# EAGLE design v1 (EAGLE 7.2.0)
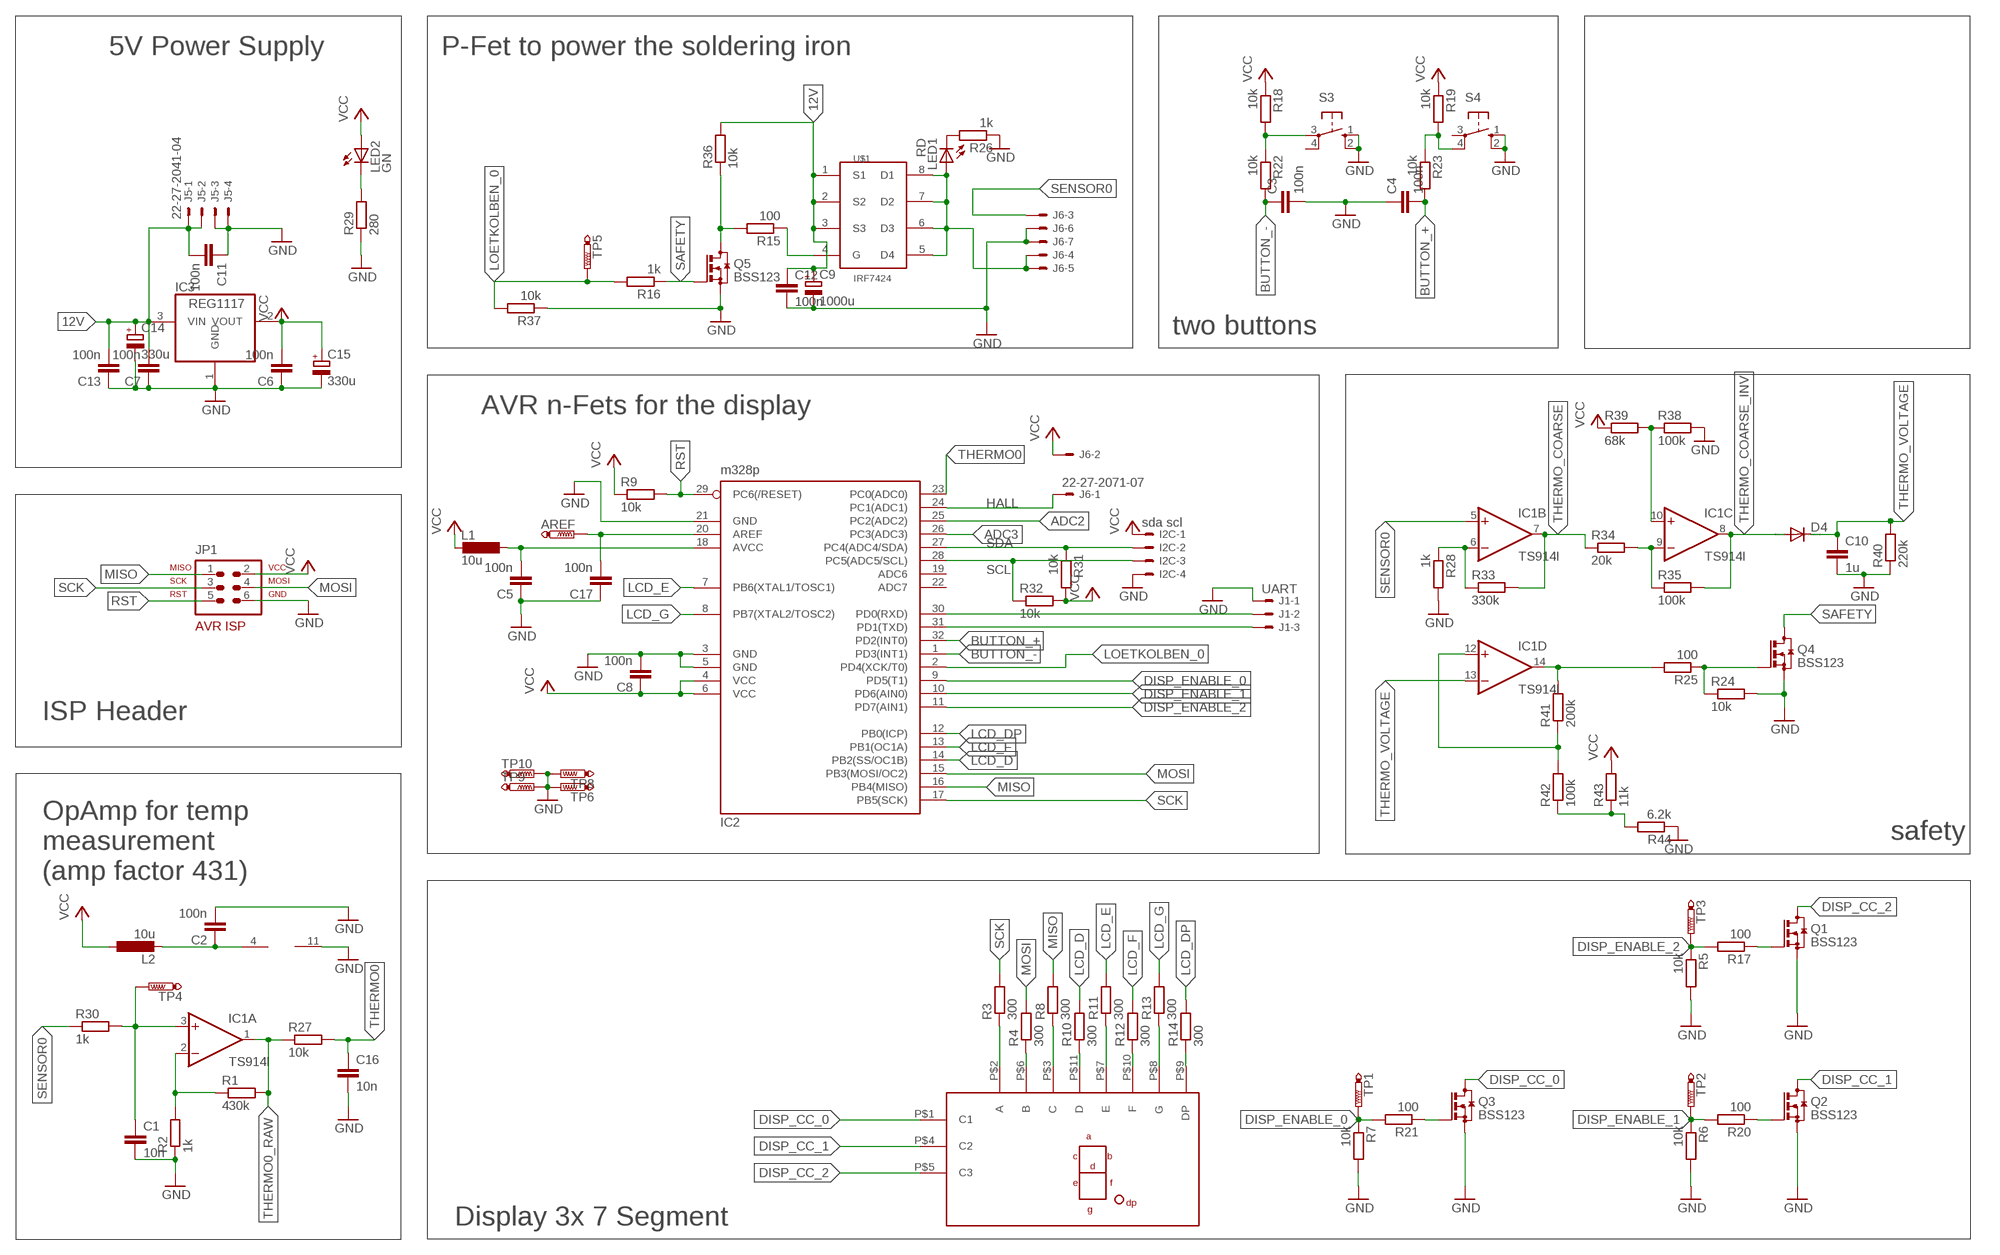
[diagram p0: schematic, sheet 1]

## Parts
AREF  PTR1B1,27  [B1,27]
C1  10n  C-EUC0603  [C0603]
C2  100n  C-EUC0603  [C0603]
C3  100n  C-EUC0603  [C0603]
C4  100n  C-EUC0603  [C0603]
C5  100n  C-EUC0603  [C0603]
C6  100n  C-EUC0603  [C0603]
C7  100n  C-EUC0603  [C0603]
C8  100n  C-EUC0603  [C0603]
C9  1000u  CPOL-EUE5-13  [E5-13]
C10  1u  C-EUC0805  [C0805]
C11  100n  C-EUC0603  [C0603]
C12  100n  C-EUC0603  [C0603]
C13  100n  C-EUC0603  [C0603]
C14  330u  CPOL-EUE3.5-8  [E3,5-8]
C15  330u  CPOL-EUE2-5  [E2-5]
C16  10n  C-EUC0603  [C0603]
C17  100n  C-EUC0603  [C0603]
D4  DIODE-DO214AC  [DO214AC]
I2C  sda scl  22-27-2041-04  [6410-04]
IC1  TS914I  LM324D  [SO14]
IC2  m328p  MEGA8-AI  [TQFP32-08]
IC3  REG1117  [SOT223]
J1  UART  22-27-2031-03  [6410-03]
J5  22-27-2041-04  [6410-04]
J6  22-27-2071-07  [6410-07]
JP1  AVR-ISP-6VERT  [AVR-ISP-6]
L1  10u  L-EUL2825P  [L2825P]
L2  10u  L-EUL2825P  [L2825P]
LED1  RD  LEDCHIP-LED0805  [CHIP-LED0805]
LED2  GN  LEDCHIP-LED0805  [CHIP-LED0805]
Q1  BSS123  [SOT23]
Q2  BSS123  [SOT23]
Q3  BSS123  [SOT23]
Q4  BSS123  [SOT23]
Q5  BSS123  [SOT23]
R1  430k  R-EU_R0603  [R0603]
R2  1k  R-EU_R0603  [R0603]
R3  300  R-EU_R0603  [R0603]
R4  300  R-EU_R0603  [R0603]
R5  10k  R-EU_R0603  [R0603]
R6  10k  R-EU_R0603  [R0603]
R7  10k  R-EU_R0603  [R0603]
R8  300  R-EU_R0603  [R0603]
R9  10k  R-EU_R0603  [R0603]
R10  300  R-EU_R0603  [R0603]
R11  300  R-EU_R0603  [R0603]
R12  300  R-EU_R0603  [R0603]
R13  300  R-EU_R0603  [R0603]
R14  300  R-EU_R0603  [R0603]
R15  100  R-EU_R0603  [R0603]
R16  1k  R-EU_R0603  [R0603]
R17  100  R-EU_R0603  [R0603]
R18  10k  R-EU_R0603  [R0603]
R19  10k  R-EU_R0603  [R0603]
R20  100  R-EU_R0603  [R0603]
R21  100  R-EU_R0603  [R0603]
R22  10k  R-EU_R0603  [R0603]
R23  10k  R-EU_R0603  [R0603]
R24  10k  R-EU_R0603  [R0603]
R25  100  R-EU_R0603  [R0603]
R26  1k  R-EU_R0603  [R0603]
R27  10k  R-EU_R0603  [R0603]
R28  1k  R-EU_R0603  [R0603]
R29  280  R-EU_R0603  [R0603]
R30  1k  R-EU_R0603  [R0603]
R31  10k  R-EU_R0603  [R0603]
R32  10k  R-EU_R0603  [R0603]
R33  330k  R-EU_R0603  [R0603]
R34  20k  R-EU_R0603  [R0603]
R35  100k  R-EU_R0603  [R0603]
R36  10k  R-EU_R0603  [R0603]
R37  10k  R-EU_R0603  [R0603]
R38  100k  R-EU_R0603  [R0603]
R39  68k  R-EU_R0603  [R0603]
R40  220k  R-EU_R0603  [R0603]
R41  200k  R-EU_R0603  [R0603]
R42  100k  R-EU_R0603  [R0603]
R43  11k  R-EU_R0603  [R0603]
R44  6.2k  R-EU_R0603  [R0603]
S3  10-XX  [B3F-10XX]
S4  10-XX  [B3F-10XX]
TP1  PTR1B1,27  [B1,27]
TP2  PTR1B1,27  [B1,27]
TP3  PTR1B1,27  [B1,27]
TP4  PTR1B1,27  [B1,27]
TP5  PTR1B1,27  [B1,27]
TP6  PTR1B1,27  [B1,27]
TP8  PTR1B1,27  [B1,27]
TP9  PTR1B1,27  [B1,27]
TP10  PTR1B1,27  [B1,27]
U$1  IRF7424  [SO-08]
U$2  3X7SEG  [3X7SEG]

## Nets
12V: C7.2 C9.+ C11.2 C12.1 C13.2 C14.+ IC3.3(VIN) J5.1 J5.2 R36.2 U$1.1(S1) U$1.2(S2) U$1.3(S3)
ADC2: IC2.25(PC2(ADC2))
ADC3: IC2.26(PC3(ADC3))
AREF: AREF.TP C17.2 IC2.20(AREF)
BUTTON_+: C4.2 IC2.32(PD2(INT0)) R23.2
BUTTON_-: C3.1 IC2.1(PD3(INT1)) R22.2
DISP_CC_0: Q3.3(D) U$2.P$1(C1)
DISP_CC_1: Q2.3(D) U$2.P$4(C2)
DISP_CC_2: Q1.3(D) U$2.P$5(C3)
DISP_ENABLE_0: IC2.9(PD5(T1)) R7.1 R21.2 TP1.TP
DISP_ENABLE_1: IC2.10(PD6(AIN0)) R6.1 R20.2 TP2.TP
DISP_ENABLE_2: IC2.11(PD7(AIN1)) R5.1 R17.2 TP3.TP
GND: C1.2 C2.2 C3.2 C4.1 C5.1 C6.1 C7.1 C8.2 C9.- C10.2 C11.1 C12.2 C13.1 C14.- C15.- C16.2 C17.1 I2C.4 IC1.11(P:V-) IC2.3(GND) IC2.5(GND) IC2.21(GND) IC3.1(GND) J1.1 J5.3 J5.4 J6.6 J6.7 JP1.6 Q1.2(S) Q2.2(S) Q3.2(S) Q4.2(S) Q5.2(S) R2.1 R5.2 R6.2 R7.2 R24.2 R26.1 R28.2 R29.1 R37.1 R38.2 R40.1 R44.1 S3.1(S) S3.2(S1) S4.1(S) S4.2(S1) TP6.TP TP8.TP TP9.TP TP10.TP
HALL: IC2.24(PC1(ADC1)) J6.1
LCD_D: IC2.14(PB2(SS/OC1B)) R10.2
LCD_DP: IC2.12(PB0(ICP)) R14.2
LCD_E: IC2.7(PB6(XTAL1/TOSC1)) R11.2
LCD_F: IC2.13(PB1(OC1A)) R12.2
LCD_G: IC2.8(PB7(XTAL2/TOSC2)) R13.2
LOETKOLBEN_0: IC2.2(PD4(XCK/T0)) R16.2 R37.2 TP5.TP
MISO: IC2.16(PB4(MISO)) JP1.1 R8.2
MOSI: IC2.15(PB3(MOSI/OC2)) JP1.4 R4.2
N$1: IC1.2(A:-IN) R1.1 R2.2
N$2: IC2.31(PD1(TXD)) J1.3
N$3: C5.2 IC2.18(AVCC) L1.1
N$4: IC2.30(PD0(RXD)) J1.2
N$5: C2.1 IC1.4(P:V+) L2.2
N$6: R3.1 U$2.P$2(A)
N$7: R4.1 U$2.P$6(B)
N$8: R8.1 U$2.P$3(C)
N$9: R10.1 U$2.P$11(D)
N$10: Q4.1(G) R24.1 R25.1
N$11: R11.1 U$2.P$7(E)
N$12: R12.1 U$2.P$10(F)
N$13: R13.1 U$2.P$8(G)
N$14: R14.1 U$2.P$9(DP)
N$15: R15.1 U$1.4(G)
N$16: IC1.6(B:-IN) R28.1 R33.1
N$17: Q2.1(G) R20.1
N$18: Q1.1(G) R17.1
N$19: Q3.1(G) R21.1
N$20: IC1.9(C:-IN) R34.2 R35.1
N$21: IC1.12(D:+IN) R41.1 R42.2
N$22: R18.2 R22.1 S3.3(P)
N$23: R19.2 R23.1 S4.4(P1)
N$24: LED2.C R29.2
N$25: LED1.C R26.2
N$26: IC1.10(C:+IN) R38.1 R39.2
N$27: C1.1 IC1.3(A:+IN) R30.2 TP4.TP
N$28: R42.1 R43.1 R44.2
N$29: IC1.14(D:OUT) R25.2 R41.2
N$32: Q5.3(D) R15.2 R36.1
N$33: J6.4 J6.5 LED1.A U$1.5(D4) U$1.6(D3) U$1.7(D2) U$1.8(D1)
RST: IC2.29(PC6(/RESET)) JP1.5 R9.2
SAFETY: Q4.3(D) Q5.1(G) R16.1
SCK: IC2.17(PB5(SCK)) JP1.3 R3.2
SCL: I2C.3 IC2.28(PC5(ADC5/SCL)) R32.1
SDA: I2C.2 IC2.27(PC4(ADC4/SDA)) R31.1
SENSOR0: IC1.5(B:+IN) J6.3 R30.1
THERMO0: C16.1 IC2.23(PC0(ADC0)) R27.2
THERMO0_RAW: IC1.1(A:OUT) R1.2 R27.1
THERMO_COARSE: IC1.7(B:OUT) R33.2 R34.1
THERMO_COARSE_INV: D4.A IC1.8(C:OUT) R35.2
THERMO_VOLTAGE: C10.1 D4.C IC1.13(D:-IN) R40.2
VCC: C6.2 C8.1 C15.+ I2C.1 IC2.4(VCC) IC2.6(VCC) IC3.2(VOUT) J6.2 JP1.2 L1.2 L2.1 LED2.A R9.1 R18.1 R19.1 R31.2 R32.2 R39.1 R43.2
Unconnected: IC2.19(ADC6) IC2.22(ADC7) S3.4(P1) S4.3(P)

## Notes on the sheet
- 5V Power Supply | P-Fet to power the soldering iron
- two buttons
- AVR n-Fets for the display
- ISP Header
- safety
- OpAmp for temp
  measurement
  (amp factor 431)
- Display 3x 7 Segment

## Library data of the parts
AREF TP1-TP6 TP8-TP10 = testpad:PTR1: TEST PIN
C1-C8 C10-C13 C16 C17 = rcl:C-EU: CAPACITOR, European symbol
C9 C14 C15 = rcl:CPOL-EU: POLARIZED CAPACITOR, European symbol
D4 = diode:DIODE-: DIODE
I2C J5 = con-molex:22-?-04: CONNECTOR wire to board 2.54 mm (.1 inch) pitch header; OC_FARNELL: unknown; OC_NEWARK: unknown
IC1 = linear:LM324: OP AMP
IC2 = atmel:MEGA8: MICROCONTROLLER 8 Kbytes FLASH, 1 kbytes SRAM, 512 bytes EEPROM, USART, 6-channel 10 bit ADC, 2-channel 8 bit ADC Pin compatible with Atmega48, ATMega88, ATMega168 Source: avr.lbr; MPN: ATMEGA8-16AU; OC_FARNELL: 9171371; OC_NEWARK: 73M8863
IC3 = burr-brown:REG1117: 800mA and 1A Low Dropout (LDO) Positive Regulator 1.8V, 2.5V, 2.85V, 3.3V, 5V, and Adj; MPN: REG1117; OC_FARNELL: 1097566; OC_NEWARK: 14P6981
J1 = con-molex:22-?-03: CONNECTOR wire to board 2.54 mm (.1 inch) pitch header; OC_FARNELL: unknown; OC_NEWARK: unknown
J6 = con-molex:22-?-07: CONNECTOR wire to board 2.54 mm (.1 inch) pitch header; OC_FARNELL: unknown; OC_NEWARK: unknown
JP1 = avr-7:AVR-ISP-6: AVR ISP-6 Serial Programming Header
L1 L2 = rcl:L-EU: INDUCTOR, European symbol
LED1 LED2 = led:LED: LED OSRAM: - CHIPLED LG R971, LG N971, LY N971, LG Q971, LY Q971, LO R971, LY R971 LH N974, LH R974 LS Q976, LO Q976, LY Q976 LO Q996 - Hyper CHIPLED LW Q18S LB Q993, LB Q99A, LB R99A - SideLED LS A670, LO A670, LY A670, LG A670, LP A670 LB A673, LV A673, LT A673, LW A673 LH A674 LY A675 LS A676, LA A676, LO A676, LY A676, LW A676 LS A679, LY A679, LG A679 - Hyper Micro SIDELED® LS Y876, LA Y876, LO Y876, LY Y876 LT Y87S - SmartLED LW L88C, LW L88S LB L89C, LB L89S, LG L890 LS L89K, LO L89K, LY L89K LS L896, LA L896, LO L896, LY L896 - TOPLED LS T670, LO T670, LY T670, LG T670, LP T670 LSG T670, LSP T670, LSY T670, LOP T670, LYG T670 LG T671, LOG T671, LSG T671 LB T673, LV T673, LT T673, LW T673 LH T674 LS T676, LA T676, LO T676, LY T676, LB T676, LH T676, LSB T676, LW T676 LB T67C, LV T67C, LT T67C, LS T67K, LO T67K, LY T67K, LW E67C LS E67B, LA E67B, LO E67B, LY E67B, LB E67C, LV E67C, LT E67C LW T67C LS T679, LY T679, LG T679 LS T770, LO T770, LY T770, LG T770, LP T770 LB T773, LV T773, LT T773, LW T773 LH T774 LS E675, LA E675, LY E675, LS T675 LS T776, LA T776, LO T776, LY T776, LB T776 LHGB T686 LT T68C, LB T68C - Hyper Mini TOPLED® LB M676 - Mini TOPLED Santana® LG M470 LS M47K, LO M47K, LY M47K Source: http://www.osram.convergy.de LUXEON: - LUMILED® LXK2-PW12-R00, LXK2-PW12-S00, LXK2-PW14-U00, LXK2-PW14-V00 LXK2-PM12-R00, LXK2-PM12-S00, LXK2-PM14-U00 LXK2-PE12-Q00, LXK2-PE12-R00, LXK2-PE12-S00, LXK2-PE14-T00, LXK2-PE14-U00 LXK2-PB12-K00, LXK2-PB12-L00, LXK2-PB12-M00, LXK2-PB14-N00, LXK2-PB14-P00, LXK2-PB14-Q00 LXK2-PR12-L00, LXK2-PR12-M00, LXK2-PR14-Q00, LXK2-PR14-R00 LXK2-PD12-Q00, LXK2-PD12-R00, LXK2-PD12-S00 LXK2-PH12-R00, LXK2-PH12-S00 LXK2-PL12-P00, LXK2-PL12-Q00, LXK2-PL12-R00 Source: www.luxeon.com KINGBRIGHT: KA-3528ASYC Source: www.kingbright.com
Q1-Q5 = transistor-small-signal:BSS123: N-CHANNEL MOS FET
R1-R44 = rcl:R-EU_: RESISTOR, European symbol
S3 S4 = switch-omron:10-XX: OMRON SWITCH; MPN: B3F-1000; OC_FARNELL: 176432; OC_NEWARK: 36M3542
U$1 = MyLib:IRF7424
U$2 = 3x7segCC:3X7SEG

## Board
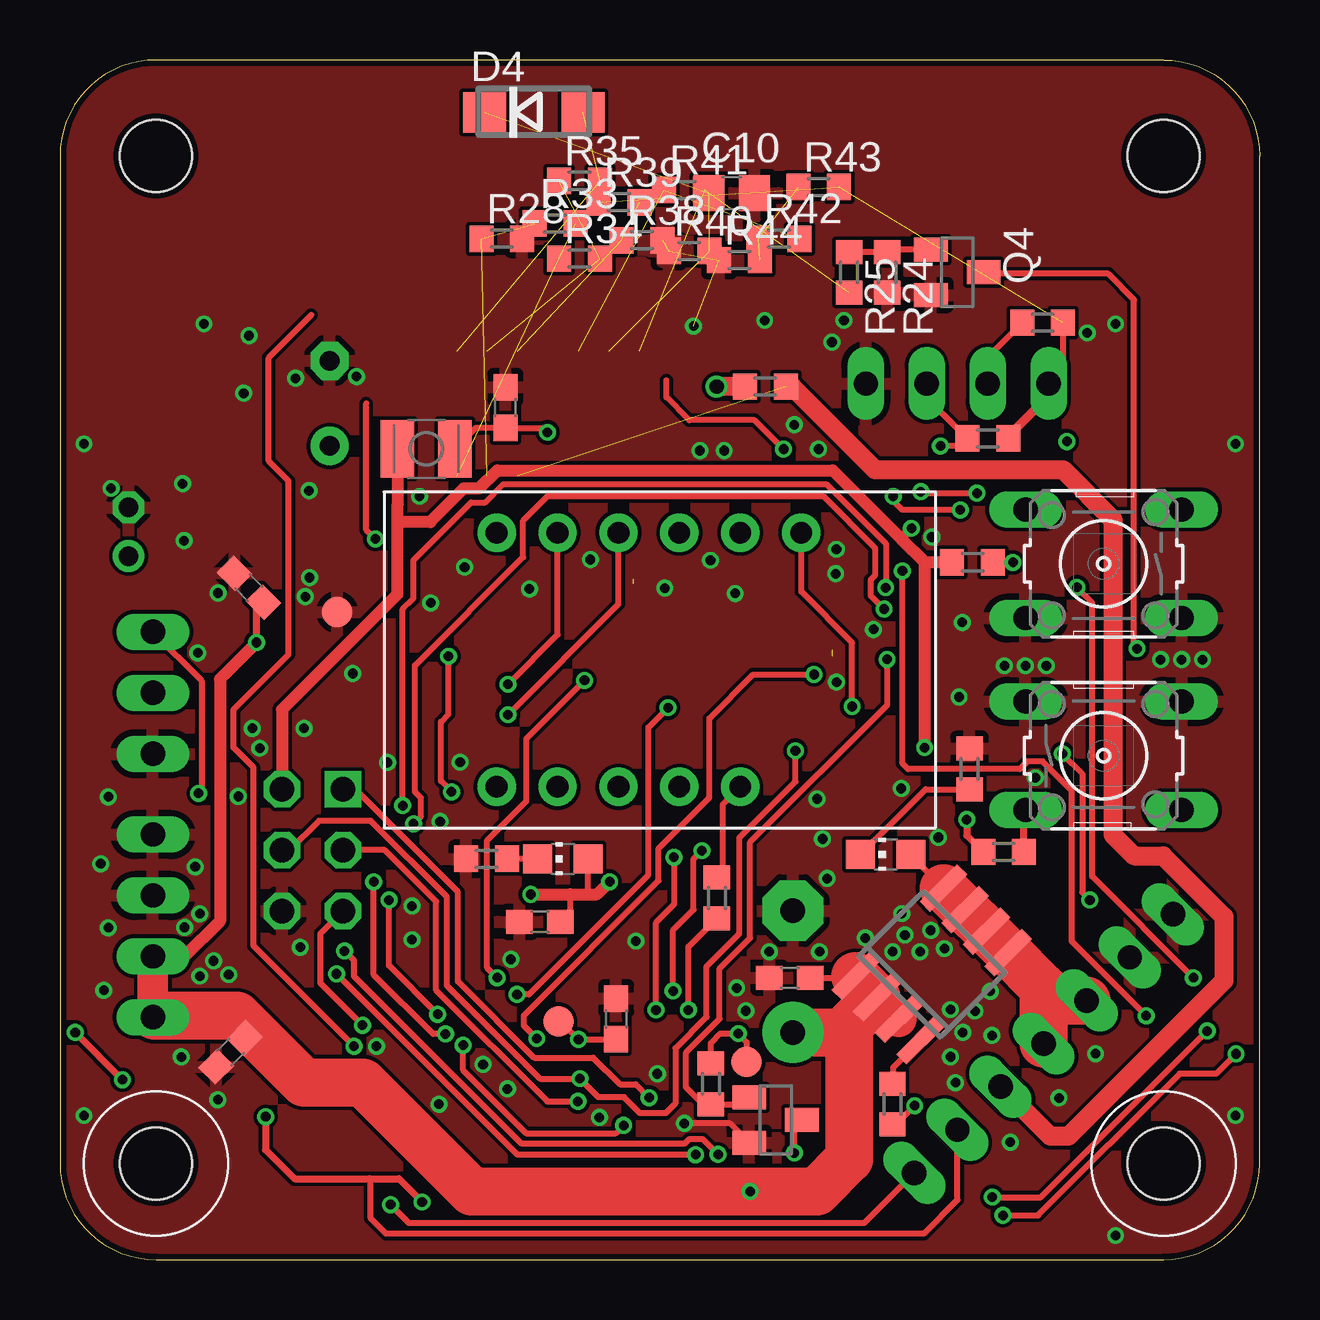
[diagram p1: board, top side]
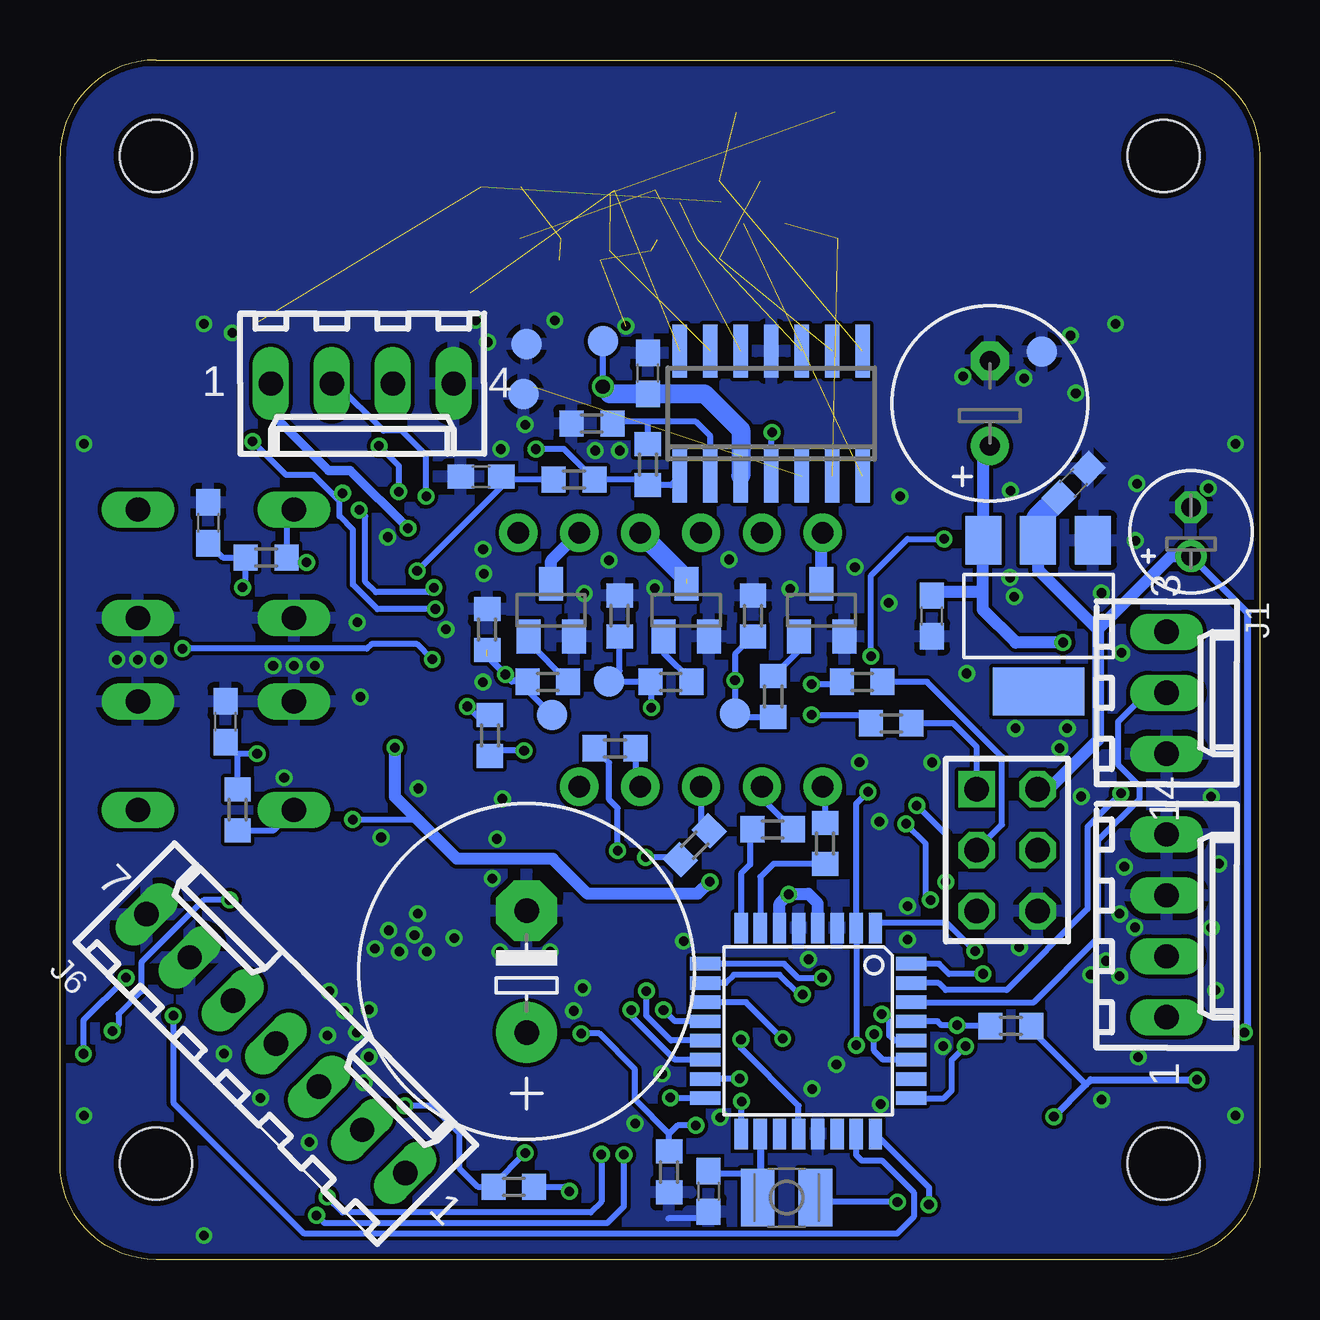
[diagram p2: board, bottom side, seen from below]

Size 50 x 50 mm. Coordinates in mm from the lower left corner, seen from the top.
Outline: 0,4 arc90 4,0 46,0 arc90 50,4 50,46 arc90 46,50 4,50 arc90 0,46 0,4
Copper layers (1*16): Top 0.035mm / dielectric 1.5mm / Bottom 0.035mm
Design rules "ITEADstudio_DRC *": minimum track width 6mil, minimum drill 12mil, track to track 6mil, track to pad 6mil, pad to pad 6mil, via to via 6mil, smd to smd 0mil, copper to edge 10mil, drill to drill 10mil, minimum pad ring 10mil, minimum via ring 6mil, stop-mask expansion 2mil, vias tented up to drill 100mil, thermal gap 10mil
Holes 3 mm at 46,4 4,4 4,46 46,46
tKeepout: area 2.5,44.5 to 5.5,47.5; area 44.5,44.5 to 47.5,47.5
bKeepout: area 44.5,44.5 to 47.5,47.5; area 2.5,44.5 to 5.5,47.5

### Footprints (pad centres in the part's own frame; a part is rotated, then mirrored left to right if it is on the bottom)
B1,27 = smd 1.27 x 1.27: TP 0,0
C0603 = smd 1.1 x 1: 1 -0.85,0; 2 0.85,0
E5-13 = drill 1.016 pad 2.54: + -2.54,0 | drill 1.016 pad 2.54 octagon: - 2.54,0
C0805 = smd 1.3 x 1.5: 1 -0.95,0; 2 0.95,0
E3,5-8 = drill 0.813 pad 1.6: + -1.778,0 | drill 0.813 pad 1.6 octagon: - 1.778,0
E2-5 = drill 0.813 pad 1.27: + -1.016,0 | drill 0.813 pad 1.27 octagon: - 1.016,0
DO214AC = smd 1.8 x 1.7: A 2.05,0; C -2.05,0
6410-04 = drill 1.016 long: 1 3.81,0; 2 1.27,0; 3 -1.27,0; 4 -3.81,0
SO14 = smd 0.6 x 2.2: 1 -3.81,-2.6; 2 -2.54,-2.6; 3 -1.27,-2.6; 4 0,-2.6; 5 1.27,-2.6; 6 2.54,-2.6; 7 3.81,-2.6; 8 3.81,2.6; 9 2.54,2.6; 10 1.27,2.6; 11 0,2.6; 12 -1.27,2.6; 13 -2.54,2.6; 14 -3.81,2.6
TQFP32-08 = smd 1.27 x 0.559: 1 -4.293,2.8; 2 -4.293,2; 3 -4.293,1.2; 4 -4.293,0.4; 5 -4.293,-0.4; 6 -4.293,-1.2; 7 -4.293,-2; 8 -4.293,-2.8; 17 4.293,-2.8; 18 4.293,-2; 19 4.293,-1.2; 20 4.293,-0.4; 21 4.293,0.4; 22 4.293,1.2; 23 4.293,2; 24 4.293,2.8 | smd 0.559 x 1.27: 9 -2.8,-4.293; 10 -2,-4.293; 11 -1.2,-4.293; 12 -0.4,-4.293; 13 0.4,-4.293; 14 1.2,-4.293; 15 2,-4.293; 16 2.8,-4.293; 25 2.8,4.293; 26 2,4.293; 27 1.2,4.293; 28 0.4,4.293; 29 -0.4,4.293; 30 -1.2,4.293; 31 -2,4.293; 32 -2.8,4.293
SOT223 = smd 1.499 x 2.007: 1 -2.261,-3.15; 2 0.025,-3.15; 3 2.311,-3.15 | smd 3.81 x 2.007: 4 0,3.15
6410-03 = drill 1.016 long: 1 2.54,0; 2 0,0; 3 -2.54,0
6410-07 = drill 1.016 long: 1 7.62,0; 2 5.08,0; 3 2.54,0; 4 0,0; 5 -2.54,0; 6 -5.08,0; 7 -7.62,0
AVR-ISP-6 = drill 1.016 square: 1 -2.54,-1.27 | drill 1.016 octagon: 2 -2.54,1.27; 3 0,-1.27; 4 0,1.27; 5 2.54,-1.27; 6 2.54,1.27
L2825P = smd 1.4 x 2.4: 1 -1.2,0; 2 1.2,0
CHIP-LED0805 = smd 1.2 x 1.2: A 0,-1.05; C 0,1.05
SOT23 = smd 1 x 1.4: 1 -0.95,-1.1; 2 0.95,-1.1; 3 0,1.1
R0603 = smd 1 x 1.1: 1 -0.85,0; 2 0.85,0
B3F-10XX = drill 1.016 long: 1 -3.251,2.261; 2 3.251,2.261; 3 -3.251,-2.261; 4 3.251,-2.261
SO-08 = smd 0.6 x 2.2: 1 -1.905,-2.6; 2 -0.635,-2.6; 3 0.635,-2.6; 4 1.905,-2.6; 5 1.905,2.6; 6 0.635,2.6; 7 -0.635,2.6; 8 -1.905,2.6
3X7SEG = drill 0.9 pad 1.6: P$1 -6.8,5.3; P$2 -4.26,5.3; P$3 -1.72,5.3; P$4 0.82,5.3; P$5 3.36,5.3; P$6 5.9,5.3; P$7 -6.8,-5.3; P$8 -4.26,-5.3; P$9 -1.72,-5.3; P$10 0.82,-5.3; P$11 3.36,-5.3

### Placement (x,y rotation side)
AREF  20.78,9.93 0 top
C1  25.5,36.94 90 bottom
C2  18.57,35.51 90 top
C3  43.1,22.42 90 bottom
C4  43.81,30.71 270 bottom
C5  22.96,2.84 90 bottom
C6  7.75,32.37 225 bottom
C7  13.65,26.83 90 bottom
C8  20,14.08 180 top
C9  30.54,12 90 bottom
C10  28,44.45 0 top
C11  7.11,8.64 45 top
C12  30.42,11.75 180 top
C13  7.87,28 315 top
C14  11.24,35.69 90 bottom
C15  2.86,30.34 90 bottom
C16  32.45,32.64 180 bottom
C17  23.18,10.03 270 top
D4  19.75,47.82 0 top
I2C  37.4,36.51 180 bottom
IC1  20.35,35.26 0 bottom
IC2  18.81,9.53 270 bottom
IC3  9.21,26.83 180 bottom
J1  3.87,23.62 270 bottom
J5  3.87,13.91 270 bottom
J6  41,9 315 bottom
JP1  10.53,17.07 270 bottom
L1  19.71,2.58 0 bottom
L2  15.27,33.79 0 top
LED1  34.42,16.89 90 top
LED2  20.95,16.7 90 top
Q1  29.53,27.07 0 bottom
Q2  23.89,27.07 0 bottom
Q3  18.26,27.07 0 bottom
Q4  37.4,41.15 270 top
Q5  29.83,5.82 270 top
R1  25.5,33.13 270 bottom
R2  27.83,34.85 0 bottom
R3  16.56,24.08 0 bottom
R4  32.08,21.84 270 bottom
R5  32.19,26.26 90 bottom
R6  26.67,26.83 90 bottom
R7  21.11,26.83 90 bottom
R8  15.35,22.35 0 bottom
R9  10.37,9.73 180 bottom
R10  27.38,15.07 270 top
R11  18.11,17.35 270 bottom
R12  26.86,21.31 180 bottom
R13  20.29,17.93 180 bottom
R14  23.55,17.27 225 bottom
R15  34.7,6.48 270 top
R16  27.13,7.33 90 top
R17  29.67,24.08 180 bottom
R18  39.33,16.99 0 top
R19  38.04,29.06 0 top
R20  24.54,24.08 180 bottom
R21  20.27,23.47 270 bottom
R22  42.6,18.75 90 bottom
R23  41.4,29.26 180 bottom
R24  34.48,41.15 270 top
R25  32.89,41.15 270 top
R26  37.91,20.45 270 top
R27  28.57,32.51 180 bottom
R28  18.41,42.55 0 top
R29  17.78,16.7 0 top
R30  29.4,36.39 180 top
R31  40.96,39.05 0 top
R32  38.67,34.23 0 top
R33  20.64,43.18 0 top
R34  21.65,41.72 0 top
R35  21.65,44.96 0 top
R36  31.08,3.03 0 bottom
R37  24.61,3.65 90 bottom
R38  24.26,42.48 0 top
R39  23.3,44.07 0 top
R40  26.23,42.04 0 top
R41  26.04,44.58 0 top
R42  29.97,42.55 0 top
R43  31.62,44.7 0 top
R44  28.32,41.66 0 top
S3  43.5,21 0 top
S4  43.5,29 180 top
TP1  21.86,22.77 0 bottom
TP2  27.12,24.1 0 bottom
TP3  29.48,22.69 0 bottom
TP4  27.37,38.27 0 bottom
TP5  28.62,8.24 0 top
TP6  11.56,26.99 0 top
TP8  9.08,37.85 0 bottom
TP9  30.54,38.16 0 bottom
TP10  30.67,36.07 0 bottom
U$1  36.34,12.3 315 top
U$2  25,25 0 top

### Tracks (layer width: path | path; a pad name or v marks a point on that pad's centre or on a via)
12V  (via drill 0.4)
  Top 0.254: C11.2 7.71,9.81 7.72,9.82 | J5.1 3.94,10.1 4,10.16 | 10.16,7.38 10.99,6.56 | C12.1 33.09,11.75 U$1.1
  Top 0.3: v8.19,25.72 8.19,27.12 C13.2
  Top 0.508: v8.19,25.72 6.67,24.19 6.67,14.1 5.2,12.63 3.88,12.63 J5.2
  Top 1: U$1.1
  Top 1.27: J5.2 J5.1
  Top 1.5: U$1.2 U$1.3
  Top 2: U$1.1 U$1.2 32.89,9.76 32.89,9.46 | 32.89,9.46 32.89,4.19 31.54,2.84 v28.77,2.84 17.16,2.84 12.62,7.38 10.16,7.38 7.72,9.82 7.38,10.16 4,10.16 3.94,10.16 | C9.+ 32.89,9.46
  Bottom 0.254: R36.2 28.96,3.03 v28.77,2.84
  Bottom 0.5: IC3.3 11.52,33.63 C14.+
  Bottom 0.508: IC3.3 11.54,30 11.54,27.69 | C7.2 13.49,27.84 11.7,27.84 11.54,27.69 | 11.54,27.69 11.54,27.1 10.16,25.72 v8.19,25.72
ADC2  (via drill 0.4)
  Top 0.254: v12.26,8.89 8.06,13.08 8.06,20.51 7.24,21.34 7.24,22.92 9.53,25.21 9.53,32.45 8.7,33.27 8.7,37.59 10.48,39.37
  Bottom 0.254: IC2.25 13.15,6.73 12.83,7.05 12.83,8.32 v12.26,8.89
AREF  (via drill 0.4)
  Top 0.254: AREF.TP 20.88,9.83 20.95,9.83 v21.61,9.17 C17.2
  Bottom 0.254: IC2.20 19.21,6.41 21.61,8.81 v21.61,9.17
BUTTON_+  (via drill 0.4)
  Top 0.254: v42.39,28.02 43.03,27.38 43.03,15.96 v47.24,11.75 | v26.49,4.37 19.06,4.37 v11.53,11.91 | v39.31,1.84 40.77,1.84 46.67,7.75 48.2,7.75 v49.02,8.57
  Bottom 0.254: v11.53,11.91 12.94,11.91 13.36,12.33 IC2.32 | C4.2 43.22,29.26 R23.2 42.25,28.16 v42.39,28.02 | v39.31,1.84 38.99,1.52 27.18,1.52 26.49,2.21 v26.49,4.37 | v47.24,11.75 49.02,9.97 v49.02,8.57
BUTTON_-  (via drill 0.4)
  Top 0.254: v47.82,9.53 40.89,2.6 v38.86,2.6 | v41.78,21.08 42.61,20.26 42.61,15.3 v42.93,14.99 | v27.43,4.38 26.8,5.02 26.23,5.02 26.04,4.83 19.24,4.83 12.26,11.81 12.26,12.46 v11.86,12.86
  Bottom 0.254: v27.43,4.38 27.43,2.41 27.88,1.97 38.23,1.97 v38.86,2.6 | R22.2 42.6,21.06 | 42.6,21.06 C3.1 | v41.78,21.08 42.57,21.08 42.6,21.06 | IC2.1 15.8,14.03 13.03,14.03 v11.86,12.86 | v42.93,14.99 44.01,14.99 46.61,12.38 46.61,11.18 47.56,10.22 47.56,9.78 v47.82,9.53
DISP_CC_0
  Bottom 0.508: Q3.3 18.26,30.24 U$2.P$1
DISP_CC_1  (1 unrouted)
  Bottom 0.762: 23.89,28.37 U$2.P$4
DISP_CC_2
  Bottom 0.508: Q1.3 29.53,29.13 U$2.P$5
DISP_ENABLE_0  (via drill 0.4)
  Top 0.254: v21.86,24.14 19.43,21.71 19.43,19.1 17.8,17.48 17.8,12.17 v18.22,11.75
  Bottom 0.254: R21.2 21.71,22.62 TP1.TP v21.86,24.14 21.86,25.23 R7.1 | IC2.9 19.82,12.33 19.24,11.75 v18.22,11.75
DISP_ENABLE_1  (via drill 0.4)
  Top 0.254: v25.35,23 24.53,22.18 24.53,16.03 19.54,11.05 v19.05,11.05
  Bottom 0.254: v19.05,11.05 19.18,11.05 20,11.87 21.91,11.87 22.25,11.53 IC2.10 | v25.35,23 25.35,24.04 R20.2 27.1,24.08 TP2.TP 26.67,24.55 R6.1
DISP_ENABLE_2  (via drill 0.4)  (1 unrouted)
  Top 0.254: v31.43,24.38 28.89,24.38 27.07,22.56 27.07,19.26 24.96,17.14 24.96,15.79 19.32,10.16 19.32,9.76 v19.88,9.21
  Bottom 0.254: 30.52,24.11 30.54,24.11 | 30.54,24.11 30.7,24.11 | v19.88,9.21 21.4,10.73 IC2.11 | TP3.TP 30.52,23.73 R17.2 30.54,24.11
  Bottom 0.3: 30.7,24.11 31.16,24.11 v31.43,24.38 32.19,25.15
GND  (via drill 0.4)  (3 unrouted)
  Top 0.254: Q5.2 27.93,5.67 v26.03,5.67
  Bottom 0.254: C5.1 23.24,1.71 24.64,1.71
  other vias: 1.7,16.49 1.83,11.22 2.02,13.83 5.64,16.37 2.02,19.29 14.67,13.34 18.65,7.11 31.56,19.2 40.24,24.75 46.75,25 39.37,24.75 41.12,24.75 47.62,25 45.88,25 42.81,38.62 5.11,32.34 10.23,27.63 10.4,28.43 6.59,27.78 13.65,20.72 35.07,19.63 6,39 1,34 44,39 49,34 49,6 44,1 1,6 7.88,38.51 10.38,32.05 12.2,24.43 19.57,27.96 22.11,29.18 27.11,29.15 32.33,28.59 15.84,18.26 26.41,38.91 26.67,33.72 22.49,5.92 25.21,27.98 16.87,28.86 15.46,27.37 33.91,26.27 32.37,24.07 5.17,29.96 7.66,36.11 24.9,7.74 36.61,17.59 36.87,12.96 37.12,10.42 38.77,11.18 38.14,10.35 37.63,9.46 37.12,8.45 33.57,13.4 36.3,13.72 35.09,14.42 35.22,13.53 34.71,12.83 35.85,12.83 14.99,31.81 16.68,20.73 29.38,39.14 32.68,39.14 9.82,36.73 12.36,36.81 41.64,6.73 38.85,9.34 37.33,7.37 43.17,8.58 39.61,4.89 2.13,32.15 5.75,25.29 31.62,33.78 36.34,30.11 37.61,26.56 37.48,23.45 28.15,27.77 28.21,11.32 28.59,10.37 29.57,12.83 31.66,12.83 31.98,15.88 31.79,17.53 24,13.27 15.8,6.48 13.19,8.89 10.02,13.02 7.03,11.87 6.4,12.45 5.83,11.81 5.19,13.84 5.83,14.41 10.17,22.14 8.01,22.14 8.33,21.31 5.05,8.44 6.58,6.66 32.37,29.6 27.69,33.72 30.61,34.8 32.18,38.24 40.66,20.08 14.67,14.73 17.64,8.13 18.8,12.51 7.43,19.3
  pour Bottom (isolate 0.152): 0,50 50,50 50,0 0,0
  pour Top (isolate 0.152): 0,50 50,50 50,0 0,0
HALL  (via drill 0.4)
  Top 0.254: v13.78,2.29 14.54,1.52 33.52,1.52 J6.1
  Bottom 0.254: IC2.24 13.78,3.01 v13.78,2.29
LCD_D  (via drill 0.4)
  Top 0.254: v26.19,10.4 26.19,13.04 R10.2
  Bottom 0.254: IC2.14 24.36,8.33 26.19,10.16 v26.19,10.4
LCD_DP  (via drill 0.4)
  Top 0.254: v24.84,10.4 24.84,14.05 25.59,14.8 v25.59,16.76
  Bottom 0.254: IC2.12 24.37,9.93 v24.84,10.4 | 24.37,16.45 R14.2 24.24,16.76 v25.59,16.76
LCD_E
  Bottom 0.254: R11.2 20.26,16.5 20.8,15.95 IC2.7
LCD_F  (via drill 0.4)
  Top 0.254: v25.56,11.19 25.56,13.73 26.42,14.59 26.42,16.7 v26.76,17.04
  Bottom 0.254: IC2.13 24.53,9.13 25.56,10.16 v25.56,11.19 | v26.76,17.04 26.76,18.82 27.11,19.18 27.11,20.71 R12.2
LCD_G
  Bottom 0.254: R13.2 21.23,17.84 21.23,16.46 21.61,16.09 IC2.8
LOETKOLBEN_0  (via drill 0.4)
  Top 0.254: R16.2 27.13,9.03 27.52,9.42 v28.28,9.42 28.62,9.07 TP5.TP | v23.5,5.59 23.18,5.27 19.43,5.27 16.81,7.89 v16.81,8.94 | v16.32,19.49 15.88,19.94 15.88,22.42 16.19,22.73 v16.19,25.15 | v13.14,30.04 12.76,30.42 12.76,35.69
  Bottom 0.254: 24.61,5.24 26.04,6.67 26.04,7.94 27.52,9.42 v28.28,9.42 | R37.2 24.61,5.24 | v16.81,8.94 IC2.2 16.81,19 v16.32,19.49 | v23.5,5.59 24.26,5.59 24.61,5.24 | v16.19,25.15 16.19,28.51 14.67,30.04 v13.14,30.04
MISO  (via drill 0.4)
  Top 0.254: v24.56,6.75 24,7.3 23.34,7.3 22.23,8.41 19.76,8.41 16.59,11.59 16.59,15.32 12.3,19.61 JP1.1
  Bottom 0.254: R8.2 12.76,22.35 11.79,21.38 JP1.1 | IC2.16 24.54,6.73 v24.56,6.75
MOSI  (via drill 0.4)
  Top 0.254: JP1.4 9.57,17.07 10.79,18.29 12.95,18.29 16.13,15.11 16.13,11.41 20,7.54 v21.67,7.54 22.45,6.76 23.51,6.76 24.18,6.1 25.24,6.1 25.65,6.51 25.65,8.8 26.96,10.11 26.96,12.22 28.32,13.59 28.32,17.59 30.66,19.93 v30.66,21.21
  Bottom 0.254: v21.67,7.54 21.68,7.53 IC2.15 | v30.66,21.21 31.86,21.21 R4.2
N$1
  Bottom 0.254: IC1.2 22.89,34.32 23.5,34.92 25.46,34.92 | 25.46,34.92 26.9,34.92 R2.2 | R1.1 25.5,34.89 25.46,34.92
N$2  (via drill 0.4)
  Top 0.254: J1.3 5.91,24.13 5.91,19.68 5.78,19.56 v5.78,19.43
  Bottom 0.254: v5.78,19.43 7.18,18.03 7.18,14.61 10.54,11.24 13.08,11.24 13.37,11.53 IC2.31
N$3
  Bottom 0.254: 21.26,3.56 22.83,3.56 C5.2
  Bottom 0.3: IC2.18 20.81,3.11 | 20.81,3.11 20.81,2.68 L1.1 | 21.26,3.56 20.81,3.11
N$4
  Bottom 0.254: IC2.30 9.4,10.73 6.73,13.4 6.73,17.46 5.02,19.18 5.02,19.75 5.91,20.64 5.91,22.42 4.7,23.62 J1.2
N$5  (via drill 0.4)
  Top 0.254: L2.2 17.33,34.66 C2.1 20.14,34.66 v20.32,34.48
  Top 0.3: L2.2 17.02,34.35
  Bottom 0.254: IC1.4 20.35,34.45 v20.32,34.48
N$6  (via drill 0.4)
  Top 0.254: v18.67,23.98 20.74,26.05 U$2.P$2
  Bottom 0.254: v18.67,23.98 17.51,23.98 R3.1
N$7  (via drill 0.4)
  Top 0.254: v33.02,23.05 33.02,25.72 30.9,27.84 U$2.P$6
  Bottom 0.254: R4.1 31.95,22.57 32.54,22.57 v33.02,23.05
N$8  (via drill 0.4)
  Top 0.254: v18.67,22.71 23.28,27.32 U$2.P$3
  Bottom 0.254: v18.67,22.71 16.56,22.71 R8.1
N$9
  Top 0.254: U$2.P$11 27.62,18.96 27.62,16.26 27.38,16.02 R10.1
N$10
  Top 0.254: Q4.1 34.58,42.1 R24.1 R25.1
N$11
  Bottom 0.254: U$2.P$7 18.11,19.61 R11.1
N$12
  Bottom 0.254: R12.1 26.01,19.89 U$2.P$10
N$13
  Bottom 0.254: R13.1 20.74,19.23 U$2.P$8
N$14
  Bottom 0.254: U$2.P$9 23.28,18.21 R14.1
N$15
  Top 0.254: U$1.4 34.73,8.01 34.73,7.49 34.7,7.46 R15.1
N$16  (2 unrouted)
N$17
  Bottom 0.254: R20.1 23.69,24.13 24.84,25.29 Q2.1
N$18
  Bottom 0.254: R17.1 30.48,25.74 Q1.1
N$19
  Bottom 0.254: Q3.1 19.21,25.38 R21.1
N$20  (2 unrouted)
N$21  (2 unrouted)
N$22
  Top 0.3: R18.2 40.18,18.67 S3.3
  Bottom 0.254: R22.1 41.09,17.89 S3.3
N$23  (via drill 0.4)
  Top 0.254: v39.73,29.06 39.66,29.06
  Top 0.3: R19.2 39.66,29.06
  Bottom 0.254: S4.4 40.55,30.96 R23.1 40.35,29.06 v39.73,29.06
N$24
  Top 0.254: LED2.C R29.2
N$25
  Top 0.254: LED1.C 36.07,19.6 R26.2
N$26  (2 unrouted)
N$27  (via drill 0.6)
  Top 0.8: R30.2 v27.37,36.39
  Bottom 0.254: v27.37,36.39 TP4.TP
  Bottom 0.8: v27.37,36.39 27.07,36.09 C1.1 23.14,36.09 21.62,34.58 IC1.3
N$28  (2 unrouted)
N$29  (2 unrouted)
N$32  (via drill 0.4)
  Top 0.254: v30.61,4.45 30.61,5.5 Q5.3 | v35.62,6.41 34.84,5.63 R15.2
  Bottom 0.254: v30.61,4.45 31.93,3.12 R36.1 32.59,3.03 33.34,3.79 33.34,5.27 34.48,6.41 v35.62,6.41
N$33
  Top 0.254: LED1.A 35.47,16.85 U$1.8
  Top 1: U$1.7 | U$1.5
  Top 2: U$1.8 U$1.7 U$1.6 U$1.5 40.89,11.43 41,11.32 | 41,11.32 41.52,10.8 J6.5 | J6.4 41,11.32
RST  (via drill 0.4)
  Top 0.254: v12.61,9.76 10.86,11.52 10.86,13.59 JP1.5
  Bottom 0.254: IC2.29 13.42,9.93 13.26,9.76 v12.61,9.76 12.58,9.73 R9.2
SAFETY  (via drill 0.4)
  Top 0.254: Q5.1 28.44,6.48 R16.1 26.8,6.48 26.1,7.18 26.1,8.64 27.5,10.03 27.5,12.13 28.77,13.4 28.77,17.4 34.48,23.11 v34.48,25.02 | v44.9,25.46 44.77,25.59 44.77,40.01 43.69,41.08 38.56,41.08 Q4.3
  Bottom 0.254: v34.48,25.02 35.12,25.65 37.02,25.65 37.21,25.46 v44.9,25.46
SCK  (via drill 0.4)
  Top 0.254: v21.59,6.59 20.32,6.59 15.68,11.22 15.68,14.92 13.54,17.07 JP1.3
  Bottom 0.254: JP1.3 10.73,18.13 10.73,20.95 13.86,24.08 R3.2 | v21.59,6.59 21.61,6.57 IC2.17
SCL  (via drill 0.4)
  Top 0.254: v15.75,10.22 13.72,12.26 v13.72,14.99 | v14.73,18.16 15.05,18.48 15.05,19.24 14.8,19.49 14.8,24.77 19.3,29.27 19.3,30.8 20.32,31.81 31.81,31.81 33.97,29.65 33.97,28.51 33.78,28.32 33.78,27.69 v34.35,27.11 | I2C.3 36.13,35.92 R32.1 37.5,33.91 v36.7,33.91 | v35.88,32 35.94,31.94 v38.23,31.94
  Bottom 0.254: IC2.28 15.22,9.13 15.43,9.34 15.43,9.91 v15.75,10.22 | v13.72,14.99 13.91,15.18 13.91,17.34 v14.73,18.16 | v34.35,27.11 36.77,27.11 37.78,28.13 37.78,30.42 38.35,30.99 38.35,31.62 | 38.35,31.62 39.43,32.7 40.58,32.7 v41.97,34.1 | v36.7,33.91 35.88,33.08 v35.88,32 | v38.23,31.94 38.35,31.81 38.35,31.62
SDA  (via drill 0.4)
  Top 0.254: v16.07,9.4 15.56,9.4 13.08,11.87 v13.08,15.75 | v14.29,18.92 14.29,27.11 14.73,27.56 14.73,29.15 17.14,31.56 17.72,31.56 18.48,32.32 31.94,32.32 34.42,29.84 v34.42,28 | R31.1 38.67,37.62 I2C.2 | v37.53,31.24 35.12,31.24 34.73,31.62 v34.73,31.81
  Bottom 0.254: IC2.27 15.69,8.33 16.07,8.7 v16.07,9.4 | v13.08,15.75 13.08,17.72 v14.29,18.92 | v34.42,28 34.61,27.81 36.83,27.81 37.27,28.26 37.27,30.99 v37.53,31.24 | v34.73,31.81 34.73,33.53 35.75,34.54 36.51,34.54 38.48,36.51 I2C.2
SENSOR0  (1 unrouted)
  Top 0.6: 39.22,7.2 J6.3
  Top 0.8: R30.1 30.51,36.39 33.98,32.92 41.81,32.92 43.89,30.83 43.89,17.7 44.77,16.83 45.97,16.83 48.51,14.29 48.51,11.62 42.04,5.14 41.27,5.14 39.22,7.2
THERMO0  (via drill 0.4)
  Top 0.254: v45.28,10.16 42.16,13.27 42.16,19.56 40.96,20.77 40.32,20.77 40.01,20.45 35.34,20.45 35.12,20.68 v35.12,28.7
  Bottom 0.254: IC2.23 16.81,4.35 16.59,4.13 15.75,4.13 14.41,2.79 14.41,1.78 15.11,1.08 39.81,1.08 45.28,6.54 v45.28,10.16 | 34.67,29.15 v35.12,28.7 31.43,32.38 | R27.2 31.3,32.51 31.43,32.38 | C16.1 31.6,32.55 31.43,32.38
THERMO0_RAW  (via drill 0.4)
  Top 0.254: v30.16,33.78 28.96,34.99 26.23,34.99 25.27,35.94 25.27,36.64
  Bottom 0.254: IC1.1 24.54,32.28 R1.2 25.73,32.51 R27.1 29,33.78 v30.16,33.78
THERMO_COARSE  (2 unrouted)
THERMO_COARSE_INV  (2 unrouted)
THERMO_VOLTAGE  (3 unrouted)
VCC  (via drill 0.4)  (2 unrouted)
  Top 0.254: LED2.A 22,15.25 22.04,15.22 | C8.1 21.27,14.5 21.27,15.22 | 12.89,3.37 12.95,3.3 12.95,1.71 13.59,1.08 36.01,1.08 37.41,2.48 J6.2 | R31.2 41.81,37.11 I2C.1 | 41.21,36.01 41.21,35.92
  Top 0.3: v15.09,2.4 14.13,3.37 12.89,3.37 9.78,3.37 8.57,4.57 v8.57,5.95 | v2.6,7.49 v0.64,9.46 | v37.8,18.34 37.8,17.68 R18.1
  Top 0.4: v35.5,30.48 35.06,30.05 | I2C.1 41.21,36.01 39.52,34.31 R32.2
  Top 0.5: L2.1 14.06,31.44
  Top 0.508: v36.04,21.34 36.04,29.06 | 36.04,29.06 35.06,30.05 32.21,32.89 18.22,32.89 17.48,32.15 16.84,32.15 15.43,30.73 14.06,30.73 | 36.04,29.06 R19.1 | JP1.2 9.26,22.92 14.06,27.73 14.06,30.73 | 14.06,30.73 14.06,31.44 | v19.63,15.22 21.27,15.22 22.04,15.22 22.38,15.22 v22.91,15.75
  Bottom 0.254: 9.23,30.88 IC3.2 | v0.64,9.46 0.48,9.61 | v37.8,18.34 35.13,18.34 35.11,18.36 | v15.09,2.4 18.33,2.4 L1.2 | R9.1 9.52,9.58 7.23,7.29
  Bottom 0.3: v8.57,5.95 7.23,7.29 7.03,7.49 v2.6,7.49 | 0.48,9.61 0.48,26.95 C15.+
  Bottom 0.4: v35.5,30.48 37.91,32.89 38.8,32.89 41.21,35.31 I2C.1
  Bottom 0.508: IC2.4 18.41,14.84 18.81,15.24 19.61,15.24 v19.63,15.22 20.01,14.84 IC2.6 | IC3.2 9.23,28.76 6.73,26.26 | v36.04,21.34 36.04,19.29 35.11,18.36 33.45,16.7 29.46,16.7 28,15.24 23.42,15.24 v22.91,15.75 | 6.73,26.26 6.73,21.65 8.78,19.61 JP1.2 | 6.73,26.26 3.67,29.32 C15.+
  Bottom 1: C6.2 9.23,30.88 IC3.2

### Text on the board
tFinish: + | - | GND | 12V | LK_0 | GND | 12V | SENS0 | v1.0 - 01/2015
bFinish: 1 | 1 | 1 | V | H | 1